# Altium schematic sheet MCISO-S00-V00-MotorcontrollerIsolation.SchDoc: Motor Controller Isolation
size A3; Author: Jonn Dillon; DrawnBy: Jonn Dillon; Project: QUTMS-MCISO-V00
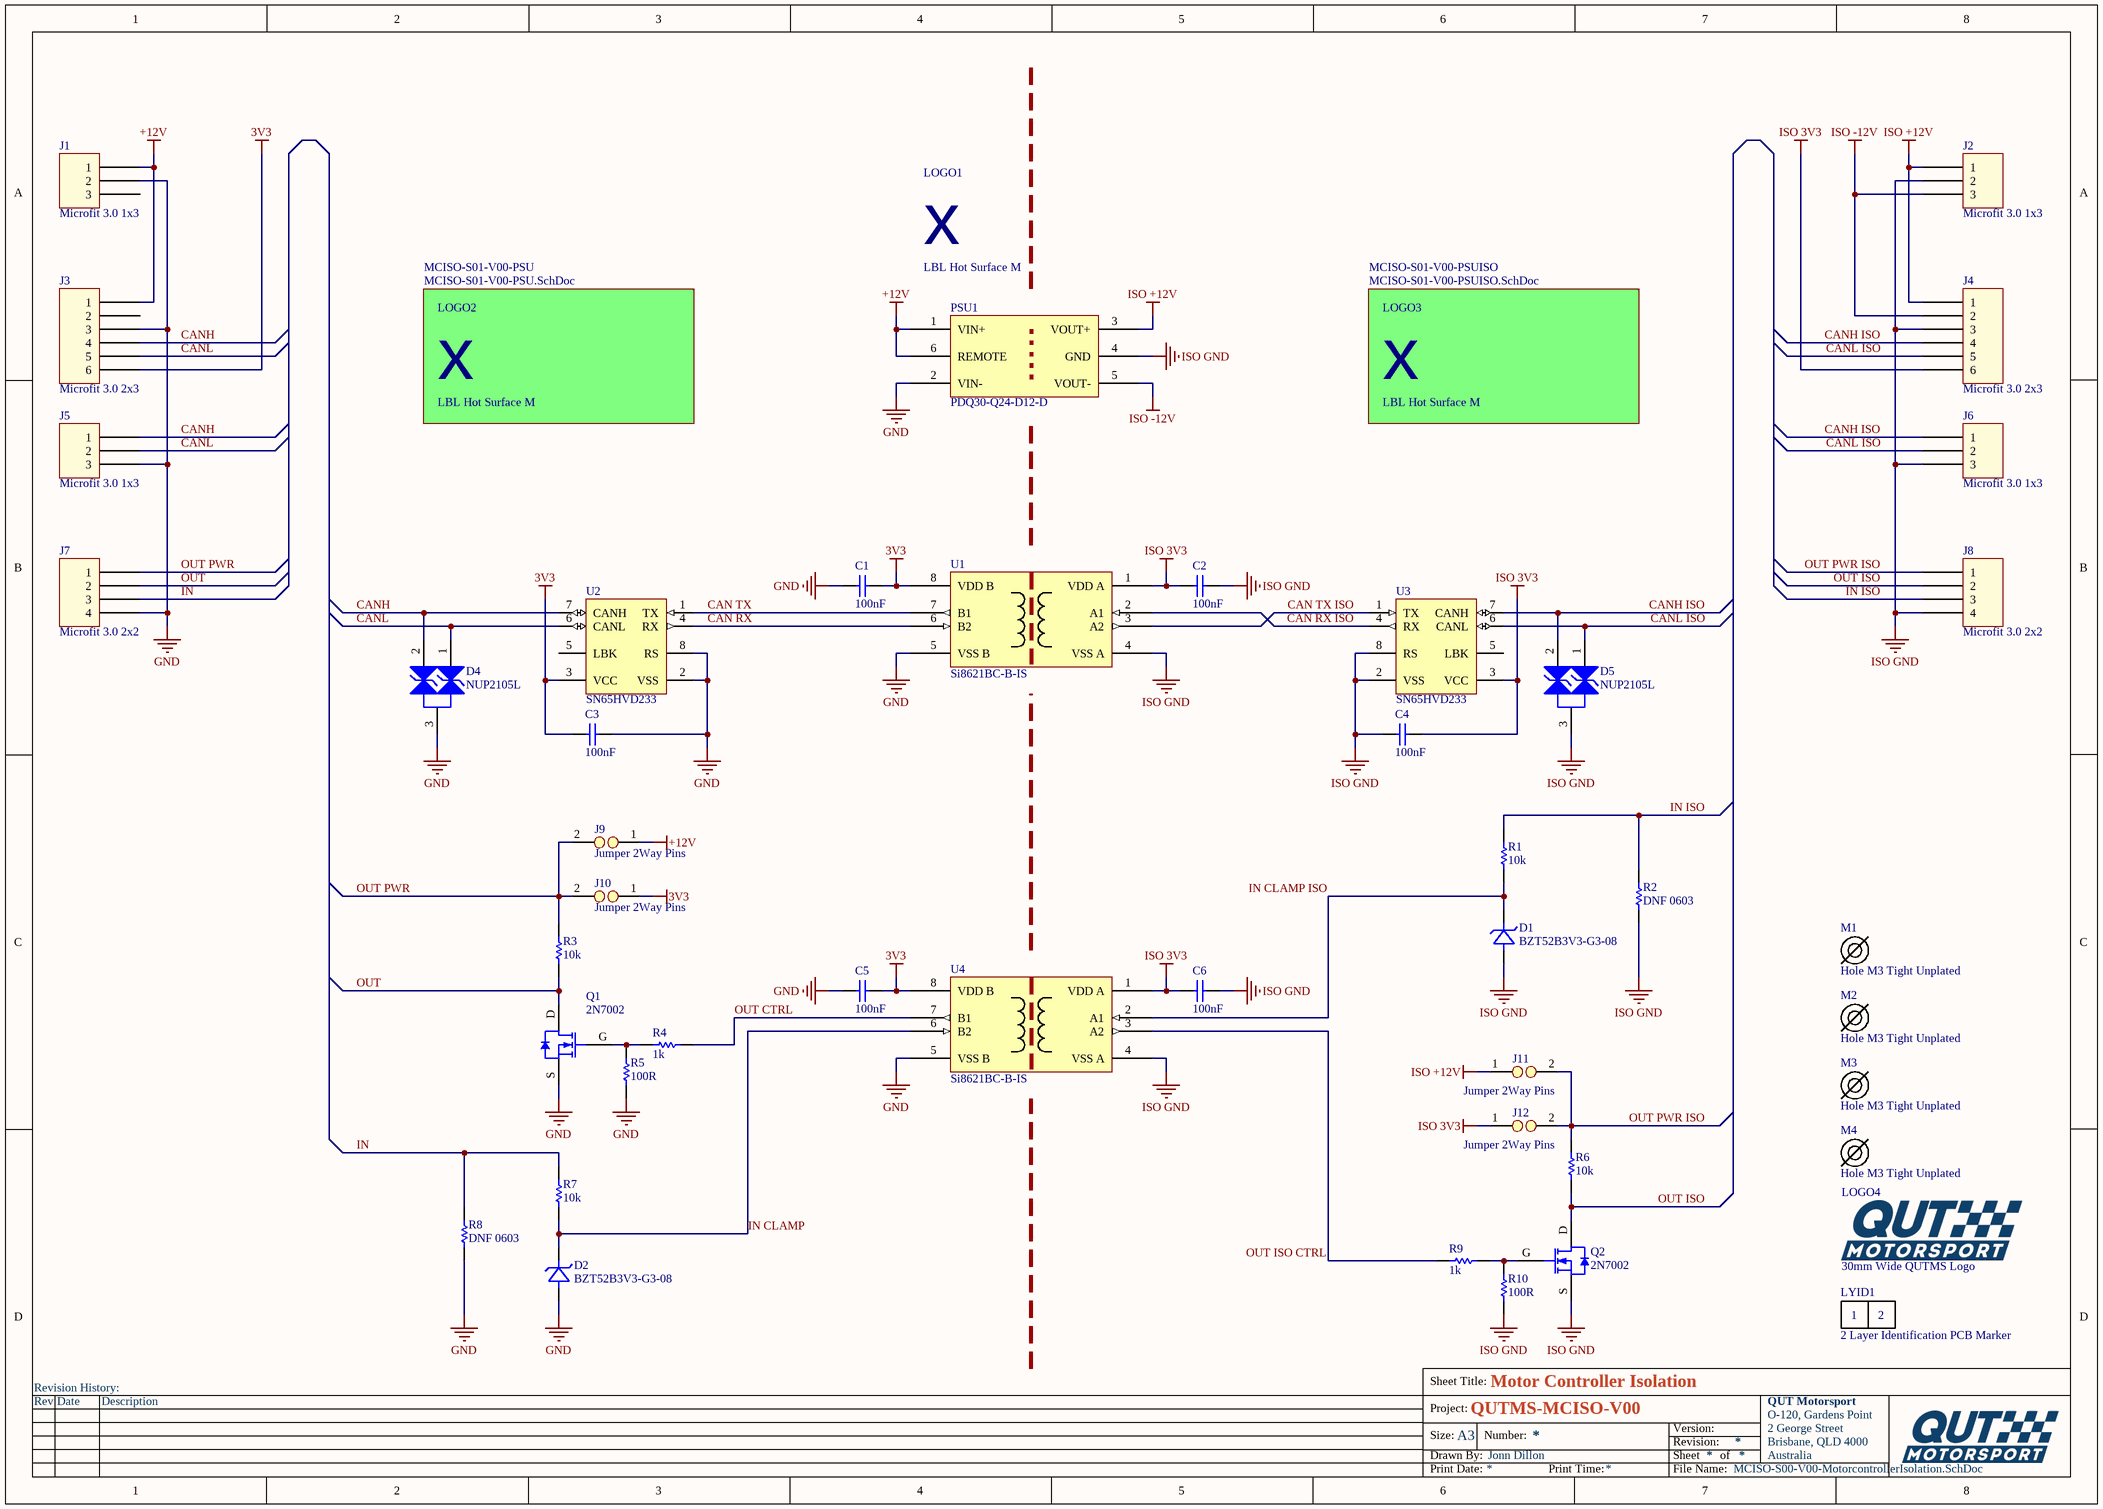
[diagram p0: MCISO-S00-V00-MotorcontrollerIsolation.SchDoc]

## Parts
C1  100nF  [Cap_Ceramic_0603]
C2  100nF  [Cap_Ceramic_0603]
C3  100nF  [Cap_Ceramic_0603]
C4  100nF  [Cap_Ceramic_0603]
C5  100nF  [Cap_Ceramic_0603]
C6  100nF  [Cap_Ceramic_0603]
D1  BZT52B3V3-G3-08  [SOD123]
D2  BZT52B3V3-G3-08  [SOD123]
D4  NUP2105L  [NUP2105L]
D5  NUP2105L  [NUP2105L]
J1  Microfit 3.0 1x3  [Microfit_1X3_R_TH]
J2  Microfit 3.0 1x3  [Microfit_1X3_R_TH]
J3  Microfit 3.0 2x3  [Microfit_2X3_R_TH]
J4  Microfit 3.0 2x3  [Microfit_2X3_R_TH]
J5  Microfit 3.0 1x3  [Microfit_1X3_R_TH]
J6  Microfit 3.0 1x3  [Microfit_1X3_R_TH]
J7  Microfit 3.0 2x2  [Microfit_2X2_R_TH]
J8  Microfit 3.0 2x2  [Microfit_2X2_R_TH]
J9  Jumper 2Way Pins  [Jumper_2Way_Pin]
J10  Jumper 2Way Pins  [Jumper_2Way_Pin]
J11  Jumper 2Way Pins  [Jumper_2Way_Pin]
J12  Jumper 2Way Pins  [Jumper_2Way_Pin]
LOGO1  LBL Hot Surface M  [LBL HOT MEDIUM]
LOGO2  LBL Hot Surface M  [LBL HOT MEDIUM]
LOGO3  LBL Hot Surface M  [LBL HOT MEDIUM]
LOGO4  30mm Wide QUTMS Logo  [QUTMS LOGO 30MM]
LYID1  2 Layer Identification PCB Marker  [LAYER IDENT 2]
M1  Hole M3 Tight Unplated  [M3.2 UNPLATED]
M2  Hole M3 Tight Unplated  [M3.2 UNPLATED]
M3  Hole M3 Tight Unplated  [M3.2 UNPLATED]
M4  Hole M3 Tight Unplated  [M3.2 UNPLATED]
PSU1  PDQ30-Q24-D12-D  [PDQ30-Q24-D12-D]
Q1  2N7002  [SOT23-3]
Q2  2N7002  [SOT23-3]
R1  10k  [Res_ThinFilm_0603]
R2  DNF 0603  [Res_ThinFilm_0603]
R3  10k  [Res_ThinFilm_0603]
R4  1k  [Res_ThinFilm_0603]
R5  100R  [Res_ThinFilm_0603]
R6  10k  [Res_ThinFilm_0603]
R7  10k  [Res_ThinFilm_0603]
R8  DNF 0603  [Res_ThinFilm_0603]
R9  1k  [Res_ThinFilm_0603]
R10  100R  [Res_ThinFilm_0603]
U1  Si8621BC-B-IS  [Si8621BC-B-IS]
U2  SN65HVD233  [SN65HVD233DR]
U3  SN65HVD233  [SN65HVD233DR]
U4  Si8621BC-B-IS  [Si8621BC-B-IS]

## Sub-sheets
MCISO-S01-V00-PSU = MCISO-S01-V00-PSU.SchDoc: no entries
MCISO-S01-V00-PSUISO = MCISO-S01-V00-PSUISO.SchDoc: no entries

## Nets
3V3: C1.2 C3.1 C5.2 J3.6 J10.1 U1.8(VDD_B) U2.3(VCC) U4.8(VDD_B)
+12V: J1.1 J3.1 J9.1 PSU1.1(VIN+) PSU1.6(REMOTE)
GND: C1.1 C3.2 C5.1 D2.A(Anode) D4.3 J1.2 J3.3 J5.3 J7.4 PSU1.2(VIN-) Q1.S R5.1 R8.1 U1.5(VSS_B) U2.2(VSS) U2.8(RS) U4.5(VSS_B)
ISO 3V3: C2.1 C4.2 C6.1 J4.6 J12.1 U1.1(VDD_A) U3.3(VCC) U4.1(VDD_A)
ISO +12V: J2.1 J4.1 J11.1 PSU1.3(VOUT+)
ISO -12V: J2.3 J4.2 PSU1.5(VOUT-)
ISO GND: C2.2 C4.1 C6.2 D1.A(Anode) D5.3 J2.2 J4.3 J6.3 J8.4 PSU1.4(GND) Q2.S R2.1 R10.1 U1.4(VSS_A) U3.2(VSS) U3.8(RS) U4.4(VSS_A)
CAN RX: U1.6(B2) U2.4(RX)
CAN RX ISO: U1.2(A1) U3.4(RX)
CAN TX: U1.7(B1) U2.1(TX)
CAN TX ISO: U1.3(A2) U3.1(TX)
CANH: D4.2 J3.4 J5.1 U2.7(CANH)
CANH ISO: D5.2 J4.4 J6.1 U3.7(CANH)
CANL: D4.1 J3.5 J5.2 U2.6(CANL)
CANL ISO: D5.1 J4.5 J6.2 U3.6(CANL)
IN: J7.3 R7.1 R8.2
IN CLAMP: D2.K(Cathode) R7.2 U4.6(B2)
IN CLAMP ISO: D1.K(Cathode) R1.1 U4.2(A1)
IN ISO: J8.3 R1.2 R2.2
OUT: J7.2 Q1.D R3.2
OUT CTRL: R4.2 U4.7(B1)
OUT ISO: J8.2 Q2.D R6.1
OUT ISO CTRL: R9.1 U4.3(A2)
OUT PWR: J7.1 J9.2 J10.2 R3.1
OUT PWR ISO: J8.1 J11.2 J12.2 R6.2
NetQ1_G: Q1.G R4.1 R5.2
NetQ2_G: Q2.G R9.2 R10.2

Not connected (* = marked no-connect by the designer): J1 3; J3 2; U2 5(LBK); U3 5(LBK)

## Notes on the sheet
- Revision History:
- Sheet Title:
- Rev
- Date
- Description
- Project:
- Size:
- Drawn By:
- A3
- Number:
- Revision:
- Sheet
- Version:
- of
- QUT Motorsport
- O-120, Gardens Point
- 2 George Street
- Brisbane, QLD 4000
- Australia
- Print Date:
- Print Time:
- File Name:
- (in symbol Layer Identification 2) 1; 2
- (in symbol LBL Hot Surface M) x

## Library data of the parts
C1-C6 = 100nF 50V 5% X7R 0603: Capacitor, Ceramic, SMD, 100nF, 50V, 5%, X7R, 0603
D1 D2 = BZT52B3V3-G3-08: Diode, SMD, Zenner, 3.3V, 2%, 410mW, SOD-123; ComponentLink1Description: Digikey; ComponentLink1URL: https://www.digikey.com.au/product-detail/en/vishay-semiconductor-diodes-division/BZT52B3V3-G3-08/BZT52B3V3-G3-08GICT-ND/8284035; ComponentLink2Description: Datasheet; ComponentLink2URL: https://www.vishay.com/docs/83340/bzt52g.pdf
J1 J2 J5 J6 = Microfit_1x3
J3 J4 = Microfit_2x3
J7 J8 = Microfit_2x2
J9-J12 = Jumper 2Way Vert Pins
LOGO4 = QUTMS Logo 30mm
LYID1 = Layer Identification 2
M1-M4 = Hole M3 Tight Unplated: M3.2 Hole, No Plating
R1 R3 R6 R7 = 10k 5% 0603: Resistor, SMD, 10k, 0.1W, 5%, 0603
R2 R8 = DNF 0603: Resistor, SMD, DNF, 0.1W, 0603
R4 R9 = 1k 5% 0603: Resistor, SMD, 1k, 0.1W, 5%, 0603
R5 R10 = 100R 5%, 0603: Resistor, SMD, 100R, 0.1W, 5%, 0603
D4 D5 = NUP2105L: ComponentLink1Description: Datasheet; ComponentLink1URL: https://www.onsemi.cn/PowerSolutions/document/NUP2105L-D.PDF; ComponentLink2Description: LCSC; ComponentLink2URL: https://lcsc.com/product-detail/TVS_ON-Semiconductor-NUP2105LT1G_C14486.html; ComponentLink3Description: Digikey; ComponentLink3URL: https://www.digikey.com.au/product-detail/en/on-semiconductor/SZNUP2105LT1G/SZNUP2105LT1GOSCT-ND/3487669
U1 U4 = Si8621BC-B-IS: ComponentLink1Description: Digikey; ComponentLink1URL: https://www.digikey.com.au/product-detail/en/silicon-labs/SI8621BC-B-ISR/336-4774-1-ND/8611005; ComponentLink2Description: Datasheet; ComponentLink2URL: https://www.silabs.com/documents/public/data-sheets/si861x-2x-datasheet.pdf
U2 U3 = SN65HVD233: ComponentLink1Description: LCSC; ComponentLink1URL: https://lcsc.com/product-detail/CAN-ICs_Texas-Instruments_SN65HVD233DRG4_Texas-Instruments-Texas-Instruments-SN65HVD233DRG4_C61643.html; ComponentLink2Description: Digikey; ComponentLink2URL: https://www.digikey.com.au/product-detail/en/texas-instruments/SN65HVD233DR/296-35967-1-ND/4134960; ComponentLink3Description: Datasheet; ComponentLink3URL: https://www.ti.com/lit/ds/symlink/sn65hvd233.pdf?ts=1588560888178; ComponentLink4Description: Ti Product Page; ComponentLink4URL: https://www.ti.com/product/SN65HVD233